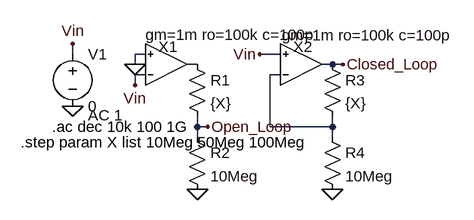
[diagram p0: schematic Opamp.asc]
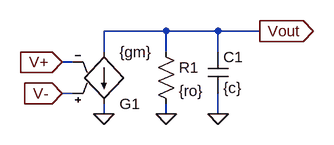
[diagram p1: sub-circuit single_stage_opamp.asc]
Opamp.asc, the LTspice schematic file:
Version 4
SHEET 1 880 680
WIRE 48 160 48 144
WIRE 160 160 144 160
WIRE 368 160 336 160
WIRE 144 176 144 160
WIRE 240 176 224 176
WIRE 448 176 432 176
WIRE 464 176 448 176
WIRE 160 192 144 192
WIRE 368 192 352 192
WIRE 144 208 144 192
WIRE 240 272 240 256
WIRE 256 272 240 272
WIRE 352 272 352 192
WIRE 448 272 448 256
WIRE 448 272 352 272
WIRE 240 288 240 272
WIRE 448 288 448 272
FLAG 48 240 0
FLAG 144 176 0
FLAG 256 272 Open_Loop
FLAG 48 144 Vin
FLAG 464 176 Closed_Loop
FLAG 336 160 Vin
FLAG 240 368 0
FLAG 144 208 Vin
FLAG 448 368 0
SYMBOL voltage 48 144 R0
WINDOW 123 24 110 Left 2
WINDOW 39 0 0 Left 2
SYMATTR Value2 AC 1
SYMATTR InstName V1
SYMATTR Value 0
SYMBOL single_stage_opamp 192 176 R0
WINDOW 39 -32 -46 Left 2
SYMATTR SpiceLine gm=1m ro=100k c=100p
SYMATTR InstName X1
SYMBOL single_stage_opamp 400 176 R0
WINDOW 39 -30 -45 Left 2
SYMATTR SpiceLine gm=1m ro=100k c=100p
SYMATTR InstName X2
SYMBOL res 224 160 R0
SYMATTR InstName R1
SYMATTR Value {X}
SYMBOL res 224 272 R0
SYMATTR InstName R2
SYMATTR Value 10Meg
SYMBOL res 432 160 R0
SYMATTR InstName R3
SYMATTR Value {X}
SYMBOL res 432 272 R0
SYMATTR InstName R4
SYMATTR Value 10Meg
TEXT 16 272 Left 2 !.ac dec 10k 100 1G
TEXT -32 296 Left 2 !.step param X list 10Meg 50Meg 100Meg

single_stage_opamp.asc, the sub-circuit schematic file:
Version 4
SHEET 1 880 680
WIRE 208 96 112 96
WIRE 288 96 208 96
WIRE 352 96 288 96
WIRE 112 128 112 96
WIRE 208 128 208 96
WIRE 288 128 288 96
WIRE 64 144 48 144
WIRE 64 192 48 192
WIRE 112 224 112 208
WIRE 208 224 208 208
WIRE 288 224 288 192
FLAG 112 224 0
FLAG 208 224 0
FLAG 288 224 0
FLAG 48 144 V+
IOPIN 48 144 In
FLAG 48 192 V-
IOPIN 48 192 In
FLAG 352 96 Vout
IOPIN 352 96 Out
SYMBOL res 192 112 R0
SYMATTR InstName R1
SYMATTR Value {ro}
SYMBOL cap 272 128 R0
SYMATTR InstName C1
SYMATTR Value {c}
SYMBOL g 112 224 M180
SYMATTR InstName G1
SYMATTR Value {gm}

The netlist it stands for:
* Opamp.asc
V1 Vin 0 0 AC 1
XX1 0 Vin N001 single_stage_opamp params: gm=1m ro=100k c=100p
XX2 Vin N002 Closed_Loop single_stage_opamp params: gm=1m ro=100k c=100p
R1 N001 Open_Loop {X}
R2 Open_Loop 0 10Meg
R3 Closed_Loop N002 {X}
R4 N002 0 10Meg

* block symbol definitions
.subckt single_stage_opamp V+ V- Vout
R1 Vout 0 {ro}
C1 Vout 0 {c}
G1 Vout 0 V- V+ {gm}
.ends single_stage_opamp

.ac dec 10k 100 1G
.step param X list 10Meg 50Meg 100Meg
.backanno
.end